# Altium schematic sheet channel34.SchDoc
size A4
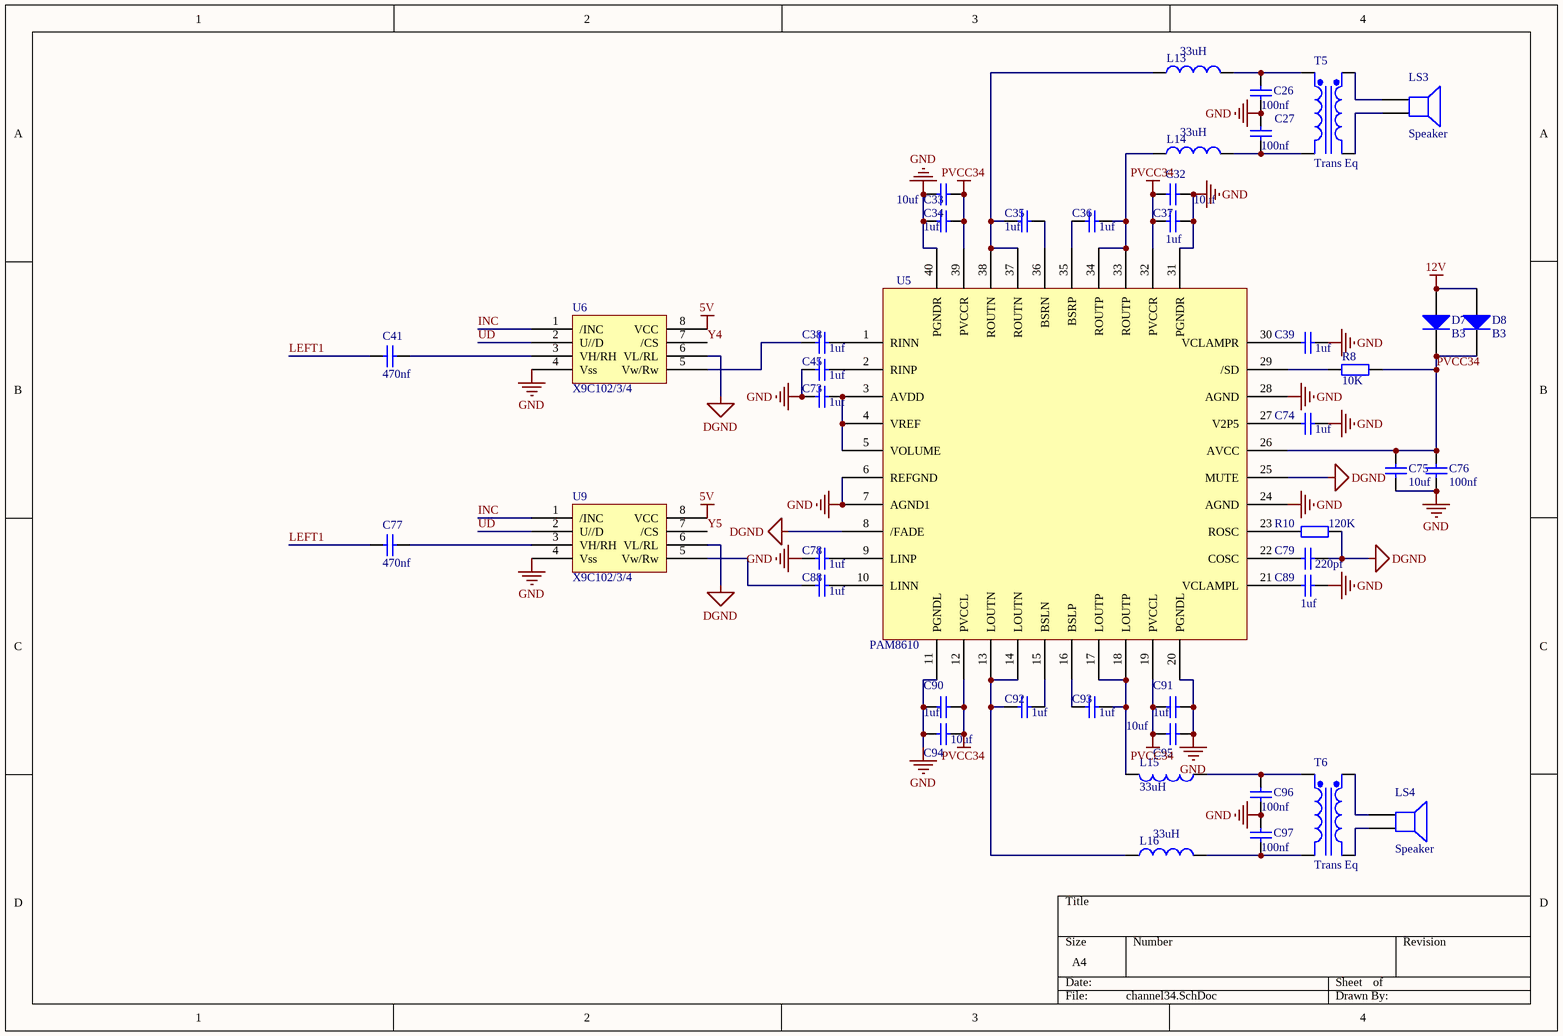
[diagram p0: channel34.SchDoc]

## Parts
C26  100nf  [0805C]
C27  100nf  [0805C]
C32  10uf  [0805C]
C33  10uf  [0805C]
C34  1uf  [0805C]
C35  1uf  [0805C]
C36  1uf  [0805C]
C37  1uf  [0805C]
C38  1uf  [0805C]
C39  1uf  [0805C]
C41  470nf  [0805C]
C45  1uf  [0805C]
C73  1uf  [0805C]
C74  1uf  [0805C]
C75  10uf  [0805C]
C76  100nf  [0805C]
C77  470nf  [0805C]
C78  1uf  [0805C]
C79  220pf  [0805C]
C88  1uf  [0805C]
C89  1uf  [0805C]
C90  1uf  [0805C]
C91  1uf  [0805C]
C92  1uf  [0805C]
C93  1uf  [0805C]
C94  10uf  [0805C]
C95  10uf  [0805C]
C96  100nf  [0805C]
C97  100nf  [0805C]
D7  B3  [LL-34 - duplicate]
D8  B3  [LL-34 - duplicate]
L13  33uH  [L0805]
L14  33uH  [L0805]
L15  33uH  [L0805]
L16  33uH  [L0805]
LS3  Speaker  [耳机座]
LS4  Speaker  [耳机座]
R8  10K  [0805R]
R10  120K  [0805R]
T5  Trans Eq  [Transistor]
T6  Trans Eq  [Transistor]
U5  PAM8610  [QFN40-0.5]
U6  X9C102/3/4  [sop_8]
U9  X9C102/3/4  [sop_8]

## Nets
5V: U6.8(VCC) U9.8(VCC)
12V: D7.1(A) D8.1(A)
DGND: C79.1 R10.2 U5.8(/FADE) U5.25(MUTE) U6.6(VL/RL) U9.6(VL/RL)
GND: C26.2 C27.1 C32.2 C33.1 C34.1 C37.2 C39.1 C45.2 C73.2 C74.1 C75.2 C76.2 C78.2 C89.2 C90.2 C91.1 C94.2 C95.1 C96.2 C97.1 U5.6(REFGND) U5.7(AGND1) U5.11(PGNDL) U5.20(PGNDL) U5.24(AGND) U5.28(AGND) U5.31(PGNDR) U5.40(PGNDR) U6.4(Vss) U9.4(Vss)
PVCC34: C32.1 C33.2 C34.2 C37.1 C75.1 C76.1 C90.1 C91.2 C94.1 C95.2 D7.2(K) D8.2(K) R8.1 U5.12(PVCCL) U5.19(PVCCL) U5.26(AVCC) U5.32(PVCCR) U5.39(PVCCR)
INC: U6.1(/INC) U9.1(/INC)
LEFT1: C41.2 C77.2
UD: U6.2(U//D) U9.2(U//D)
Y4: U6.7(/CS)
Y5: U9.7(/CS)
NetC26_1: C26.1 L13.2 T5.1(Pri+)
NetC27_2: C27.2 L14.2 T5.2(Pri-)
NetC35_1: C35.1 U5.36(BSRN)
NetC35_2: C35.2 L13.1 U5.37(ROUTN) U5.38(ROUTN)
NetC36_1: C36.1 L14.1 U5.33(ROUTP) U5.34(ROUTP)
NetC36_2: C36.2 U5.35(BSRP)
NetC38_1: C38.1 U5.1(RINN)
NetC38_2: C38.2 U6.5(Vw/Rw)
NetC39_2: C39.2 U5.30(VCLAMPR)
NetC41_1: C41.1 U6.3(VH/RH)
NetC45_1: C45.1 U5.2(RINP)
NetC73_1: C73.1 U5.3(AVDD) U5.4(VREF) U5.5(VOLUME)
NetC74_2: C74.2 U5.27(V2P5)
NetC77_1: C77.1 U9.3(VH/RH)
NetC78_1: C78.1 U5.9(LINP)
NetC79_2: C79.2 U5.22(COSC)
NetC88_1: C88.1 U5.10(LINN)
NetC88_2: C88.2 U9.5(Vw/Rw)
NetC89_1: C89.1 U5.21(VCLAMPL)
NetC92_1: C92.1 U5.15(BSLN)
NetC92_2: C92.2 L16.1 U5.13(LOUTN) U5.14(LOUTN)
NetC93_1: C93.1 L15.2 U5.17(LOUTP) U5.18(LOUTP)
NetC93_2: C93.2 U5.16(BSLP)
NetC96_1: C96.1 L15.1 T6.1(Pri+)
NetC97_2: C97.2 L16.2 T6.2(Pri-)
NetLS3_1: LS3.1 T5.3(Sec+)
NetLS3_2: LS3.2 T5.4(Sec-)
NetLS4_1: LS4.1 T6.3(Sec+)
NetLS4_2: LS4.2 T6.4(Sec-)
NetR8_2: R8.2 U5.29(/SD)
NetR10_1: R10.1 U5.23(ROSC)

## Library data of the parts
C26 C27 C32-C39 C41 C45 C73-C79 C88-C97 = Cap: Capacitor; Value: 0.1uF; Published: 8-Jun-2000; LatestRevisionDate: 17-Jul-2002; LatestRevisionNote: Re-released for DXP Platform.; PackageReference: RAD-0.3; Publisher: Altium Limited; PackageDescription: Radial Cap, Thru-Hole; 2 Leads; 0.3 in Pin Spacing
D7 D8 = Diode 1N4148: High Conductance Fast Diode; Published: 8-Jun-2000; LatestRevisionDate: 17-Jul-2002; LatestRevisionNote: Re-released for DXP Platform.; DatasheetVersion: 1997; PackageReference: DO-35; Publisher: Altium Limited; PackageDescription: Diode, Axial; Body 3.8 x 1.9 mm (LxDia. max), Lead Dia. 0.53 mm (max); Code_JEDEC: DO-204-AH; ComponentLink1Description: Manufacturer Link; ComponentLink1URL: http://www.fairchildsemi.com/; ComponentLink2Description: Datasheet; ComponentLink2URL: http://www.fairchildsemi.com/ds/1N%2F1N4148.pdf
L13-L16 = Inductor: Code_IEC: 1005; Published: 8-Jun-2000; LatestRevisionDate: 29-May-2009; LatestRevisionNote: IPC-7351 Footprint Added.; PackageReference: 0402-A; Publisher: Altium Limited; PackageDescription: Chip Inductor; Code_JEITA: 0402
LS3 LS4 = Speaker: Loudspeaker; Published: 24-Mar-1999; LatestRevisionDate: 17-Jul-2002; LatestRevisionNote: Re-released for DXP Platform.; PackageReference: PIN2; Publisher: Altium Limited
R8 = Res2: Resistor; Published: 8-Jun-2000; LatestRevisionDate: 17-Jul-2002; LatestRevisionNote: Re-released for DXP Platform.; PackageReference: AXIAL-0.4; Publisher: Altium Limited; PackageDescription: Axial Device, Thru-Hole; 2 Leads; 0.4 in Pin Spacing; Value: 10K
R10 = Res2: Resistor; Value: 10K; Published: 8-Jun-2000; LatestRevisionDate: 17-Jul-2002; LatestRevisionNote: Re-released for DXP Platform.; PackageReference: AXIAL-0.4; Publisher: Altium Limited; PackageDescription: Axial Device, Thru-Hole; 2 Leads; 0.4 in Pin Spacing
T5 T6 = Trans Eq: Transformer (Equivalent Circuit Model); Published: 8-Jun-2000; LatestRevisionDate: 17-Jul-2002; LatestRevisionNote: Re-released for DXP Platform.; PackageReference: TRF_4; Publisher: Altium Limited; PackageDescription: Transformer; 4 Leads